# EAGLE schematic header2313 (EAGLE 6.2)
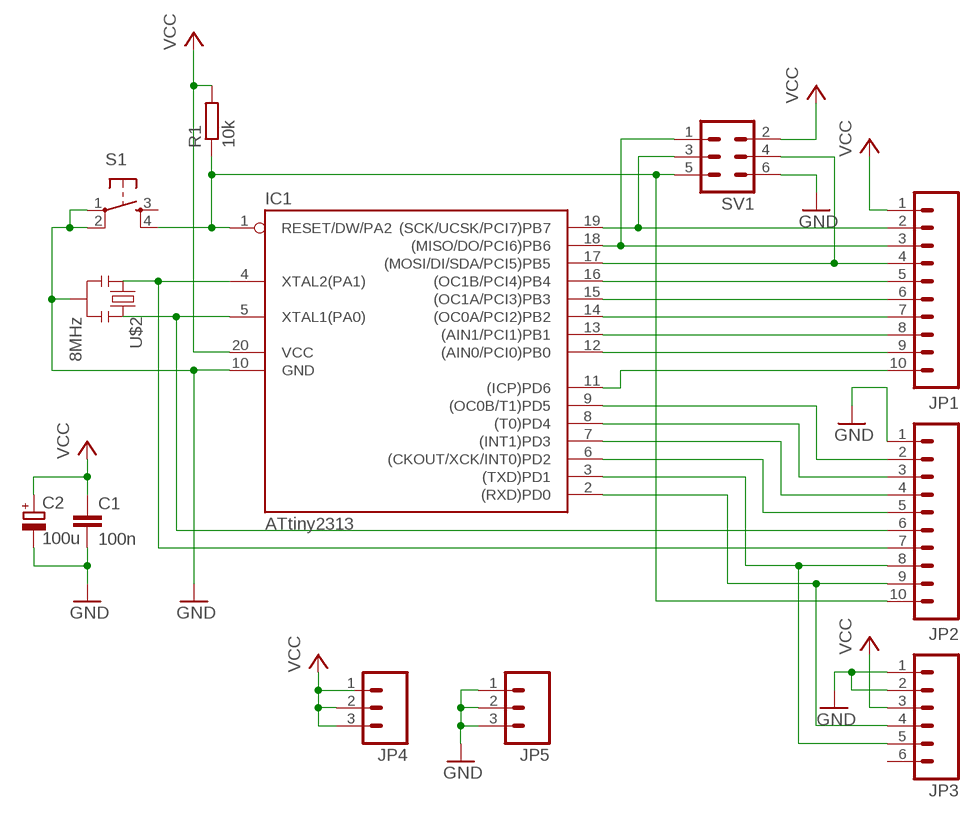
[diagram p0: schematic, sheet 1]

## Parts
C1  100n  C-EU025-025X050  [C025-025X050]
C2  100u  CPOL-EUE2.5-5  [E2,5-5]
IC1  ATtiny2313  ATTINY2313-20P  [DIL20]
JP1  M100.1  [1X10]
JP2  M100.1  [1X10]
JP3  M06SIP  [1X06]
JP4  M03PTH  [1X03]
JP5  M03PTH  [1X03]
R1  10k  R-EU_0207/10  [0207/10]
S1  TAC_SWITCHPTH  [TACTILE-PTH]
SV1  MA03-2  [MA03-2]
U$2  8MHz  RESONATORPTH  [RESONATOR-PTH]

## Nets
GND: C1.2 C2.- IC1.10(GND) JP2.1 JP3.1 JP3.2 JP5.1 JP5.2 JP5.3 S1.1 S1.2 SV1.6 U$2.2
N$2: IC1.4(XTAL2(PA1)) JP2.7 U$2.1
N$3: IC1.5(XTAL1(PA0)) JP2.6 U$2.3
N$4: IC1.1(RESET/DW/PA2) JP2.10 R1.1 S1.4 SV1.5
N$5: IC1.19((SCK/UCSK/PCI7)PB7) JP1.2 SV1.3
N$6: IC1.18((MISO/DO/PCI6)PB6) JP1.3 SV1.1
N$7: IC1.17((MOSI/DI/SDA/PCI5)PB5) JP1.4 SV1.4
N$8: IC1.16((OC1B/PCI4)PB4) JP1.5
N$9: IC1.15((OC1A/PCI3)PB3) JP1.6
N$10: IC1.14((OC0A/PCI2)PB2) JP1.7
N$11: IC1.13((AIN1/PCI1)PB1) JP1.8
N$12: IC1.12((AIN0/PCI0)PB0) JP1.9
N$13: IC1.11((ICP)PD6) JP1.10
N$14: IC1.9((OC0B/T1)PD5) JP2.2
N$15: IC1.8((T0)PD4) JP2.3
N$16: IC1.7((INT1)PD3) JP2.4
N$17: IC1.6((CKOUT/XCK/INT0)PD2) JP2.5
N$18: IC1.3((TXD)PD1) JP2.8 JP3.5
RX: IC1.2((RXD)PD0) JP2.9 JP3.4
VCC: C1.1 C2.+ IC1.20(VCC) JP1.1 JP3.3 JP4.1 JP4.2 JP4.3 R1.2 SV1.2
Unconnected: JP3.6 S1.3

## Library data of the parts
C1 = rcl:C-EU: CAPACITOR, European symbol
C2 = rcl:CPOL-EU: POLARIZED CAPACITOR, European symbol
IC1 = avr:ATTINY2313: MICROCONTROLLER 2 Kbytes FLASH 128 bytes SRAM 128 bytes EEPROM USART USI
JP1 JP2 = SparkFun:M10: Header 10 Standard 10-pin 0.1" header. Use with straight break away headers (SKU : PRT-00116), right angle break away headers (PRT-00553), swiss pins (PRT-00743), machine pins (PRT-00117), and female headers (PRT-00115).
JP3 = SparkFun:M06: Header 6 Standard 6-pin 0.1" header. Use with straight break away headers (SKU : PRT-00116), right angle break away headers (PRT-00553), swiss pins (PRT-00743), machine pins (PRT-00117), and female headers (PRT-00115). Molex polarized connector foot print use with SKU : PRT-08094 with associated crimp pins and housings.
JP4 JP5 = SparkFun-Connectors:M03: Header 3 Standard 3-pin 0.1" header. Use with straight break away headers (SKU : PRT-00116), right angle break away headers (PRT-00553), swiss pins (PRT-00743), machine pins (PRT-00117), and female headers (PRT-00115). Molex polarized connector foot print use with SKU : PRT-08232 with associated crimp pins and housings.
R1 = rcl:R-EU_: RESISTOR, European symbol
S1 = SparkFun-Electromechanical:TAC_SWITCH: Momentary Switch Button commonly used for reset or general input. Spark Fun Electronics SKU : COM-00097 SMT- SWCH-08247
SV1 = con-lstb:MA03-2: PIN HEADER; OC_FARNELL: unknown; OC_NEWARK: unknown
U$2 = SparkFun:RESONATOR: Resonator Small SMD resonator. This is the itty bitty 10/20MHz resonators with built in caps. CSTCE10M0G55 and CSTCE20M0V53. Footprint has been reviewed closely but hasn't been tested yet.